# Altium project Aether.PrjPcb
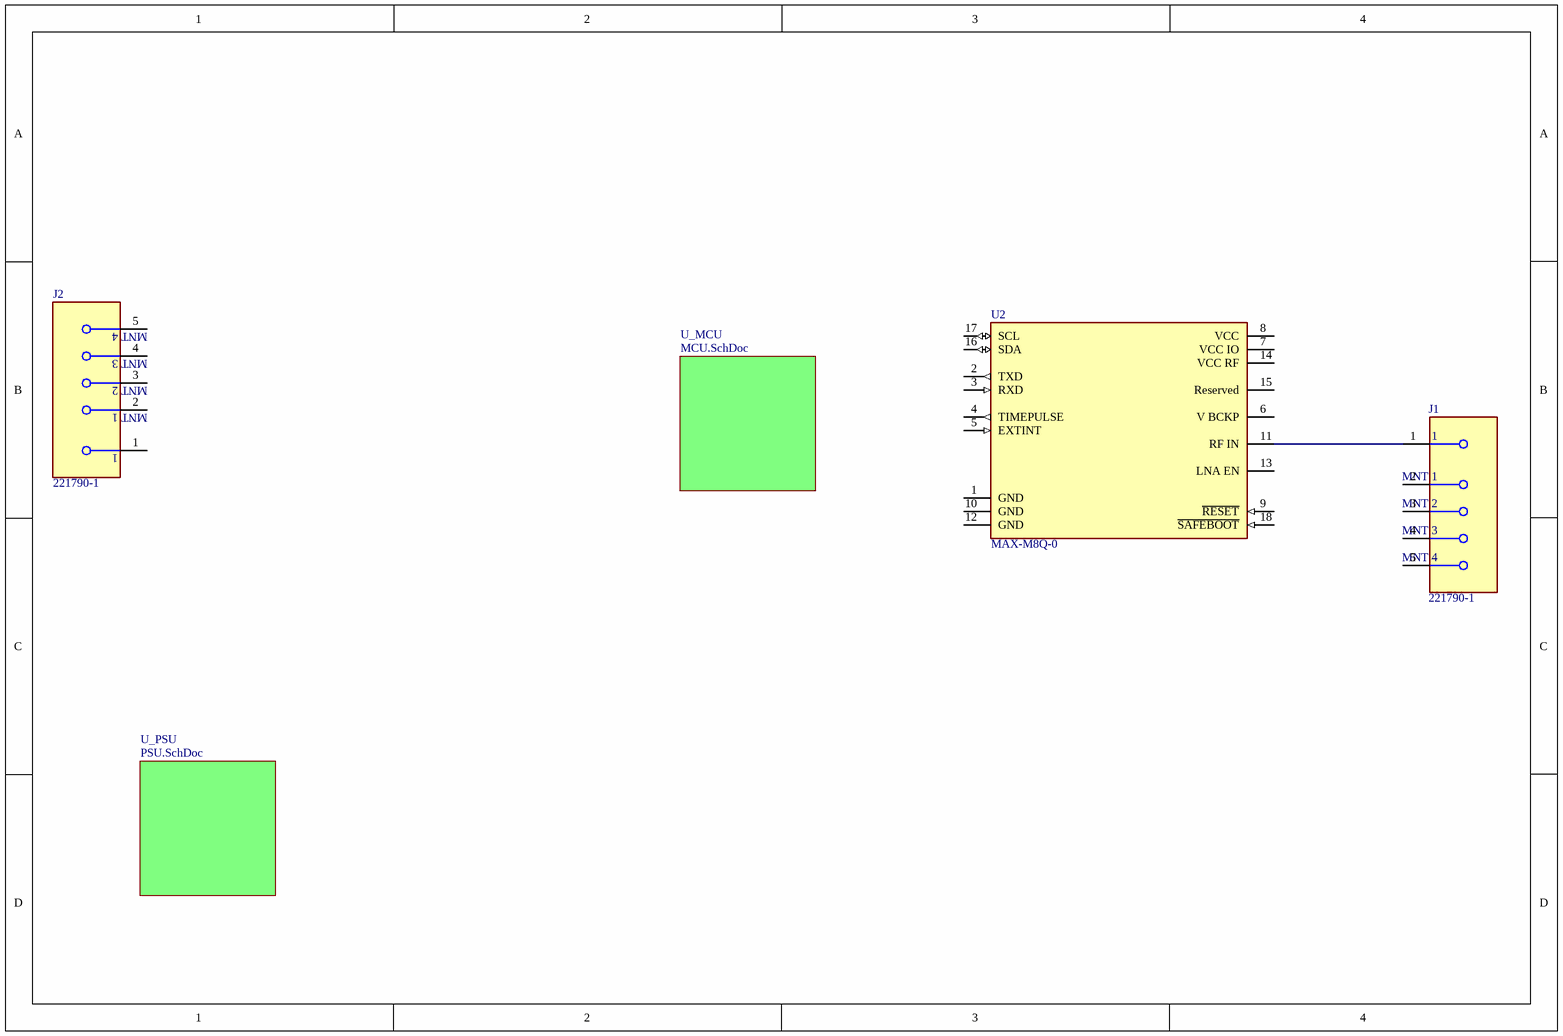
[diagram p0: main.SchDoc]
Title: testtest; Revision: 001; Project: XXX; DrawnBy: Jim Beam; Date: YYYY-MM-DD; CheckedBy: Rudolf Jelinek; ApprovedBy: Rani Srani
3 sheets, 4 parts. Net scope: global (net labels, ports and power ports of the same name join across sheets).
Board file: Aether.PcbDoc
Sheets:
  main.SchDoc
    U_MCU = MCU.SchDoc
    U_PSU = PSU.SchDoc

## Sheet main.SchDoc: testtest
size A4; Date: YYYY-MM-DD; ApprovedBy: Rani Srani; CheckedBy: Rudolf Jelinek; DrawnBy: Jim Beam; Organization: Medical Technologies CZ a.s.; Revision: 001; Version1: N/A; Version2: N/A; Version3: N/A; Change1description: N/A; Change2description: N/A; Change3description: N/A; Change1DrawnBy: N/A; Change2DrawnBy: N/A; Change3DrawnBy: N/A; Change1CheckedBy: N/A; Change2CheckedBy: N/A; Change3CheckedBy: N/A; PreviusVersion_Chng1: N/A; PreviusVersion_Chng2: N/A; PreviusVersion_Chng3: N/A; Variant1description: Standard assembly; Variant2description: N/A; Variant3description: N/A; Variant4description: N/A; PrimaryCard1: XXXxxxXXX; PrimaryCard2: N/A; PrimaryCard3: N/A; PrimaryCard4: N/A; DocumentName: Docname

### Parts
J1  221790-1  [FP-221790-1-MFG]
J2  221790-1  [FP-221790-1-MFG]
U2  MAX-M8Q-0  [FP-MAX-M8Q-0-MFG]

### Sub-sheets
U_MCU = MCU.SchDoc: no entries
U_PSU = PSU.SchDoc: no entries

### Nets
NetJ1_1: J1.1 U2.11(RF_IN)

Not connected (* = marked no-connect by the designer): J1 2(MNT_1) 3(MNT_2) 4(MNT_3) 5(MNT_4); J2 1 2(MNT_1) 3(MNT_2) 4(MNT_3) 5(MNT_4); U2 1(GND) 2(TXD) 3(RXD) 4(TIMEPULSE) 5(EXTINT) 6(V_BCKP) 7(VCC_IO) 8(VCC) 9(~{RESET}) 10(GND) 12(GND) 13(LNA_EN) 14(VCC_RF) 15(Reserved) 16(SDA) 17(SCL) 18(~{SAFEBOOT})

### Notes on the sheet
- Číslo výkresu /drawing number/:
- Nazev listu/sheet name/:
- DPS projekt/PCB project/:
- Kreslil /drawn by/ :
- Kontroloval /checked by/:
- Schvalil /approved by/:
- Podpis /signature/:
- Datum /date/:
- List /sheet/:
- /

### Library data of the parts
J1 J2 = CMP-05166-000001-1: CONN SMA JACK R/A 50 OHM PCB; Manufacturer: TE Connectivity / AMP; Is Female: yes; Impedance: 50Ω; Number Of Contacts: 1; Shielding: true; Voltage Rating: 335V; Frequency: 4GHz; Dielectric Material: Fluoropolymer; Conn Orientation: Right Angle; Octopart: https://octopart.com/2217901-te+connectivity+%2F+amp-3339836; Contact Material: Gold; Temperature: -65°C to +165°C; RoHS: TRUE; Device Class L1: Connectors; Temperature Range Low: -65°C; Mouser Description: RF Connectors / Coaxial Connectors PCB RIGHT ANGLE JACK; Lead Free: Yes; Manufacturer Part Number: 221790-1; Device Class L3: unset; Temperature Range High: +165°C; ComponentLink2URL: https://www.te.com/commerce/DocumentDelivery/DDEController?Action=showdoc&DocId=Customer+Drawing%7F221790%7FB1%7Fpdf%7FEnglish%7FENG_CD_221790_B1.pdf%7F221790-1; Package: 0; ComponentLink2Description: Datasheet; Digikey Description: CONN SMA JACK R/A 50 OHM PCB; Device Class L2: RF / Coaxial Connectors; Category: Conn; Height: 0.38inch; Automotive: No
U2 = CMP-207130-000017-1: RF RCVR GNSS/GPS 1.575GHZ 18LCC; Sensitivity: -167dBm; Current - Receiving: 23mA; Interface: I2C; Frequency: 1.575GHz; Min Operating Temperature: -40°C; Case/Package: SMD/SMT; RoHS Compliant: Yes; Packaging: Cut Tape; Max Operating Temperature: 85°C

## Sheet MCU.SchDoc: testtest
size A4; Date: YYYY-MM-DD; ApprovedBy: Rani Srani; CheckedBy: Rudolf Jelinek; DrawnBy: Jim Beam; Organization: Medical Technologies CZ a.s.; Revision: 001; Version1: N/A; Version2: N/A; Version3: N/A; Change1description: N/A; Change2description: N/A; Change3description: N/A; Change1DrawnBy: N/A; Change2DrawnBy: N/A; Change3DrawnBy: N/A; Change1CheckedBy: N/A; Change2CheckedBy: N/A; Change3CheckedBy: N/A; PreviusVersion_Chng1: N/A; PreviusVersion_Chng2: N/A; PreviusVersion_Chng3: N/A; Variant1description: Standard assembly; Variant2description: N/A; Variant3description: N/A; Variant4description: N/A; PrimaryCard1: XXXxxxXXX; PrimaryCard2: N/A; PrimaryCard3: N/A; PrimaryCard4: N/A; DocumentName: Docname
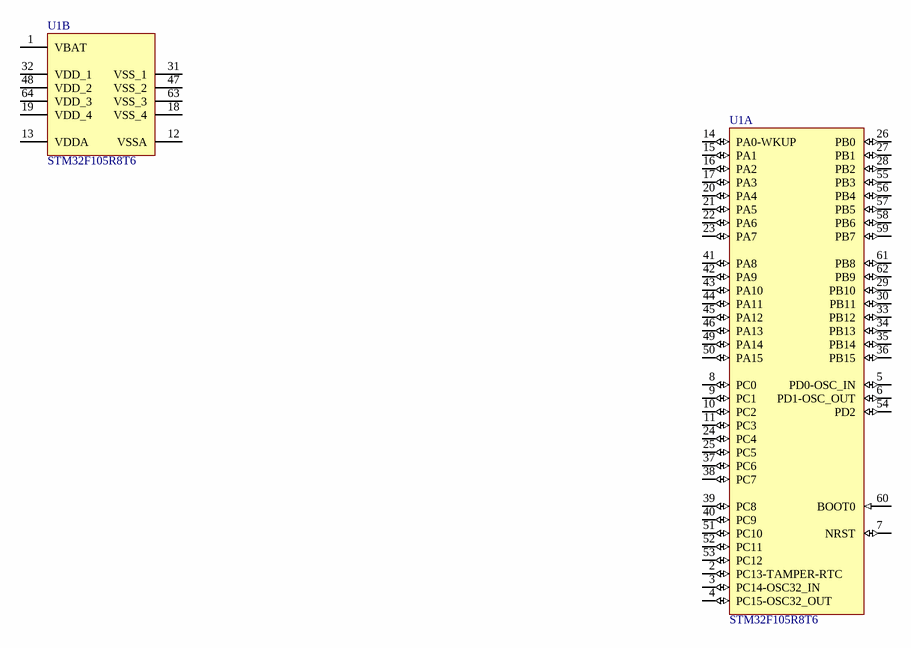
[diagram p1: MCU.SchDoc]

### Parts
U1  STM32F105R8T6  [STM-LQFP64_V]  (parts A,B of 2)

### Nets

Not connected (* = marked no-connect by the designer): U1 1(VBAT) 2(PC13-TAMPER-RTC) 3(PC14-OSC32_IN) 4(PC15-OSC32_OUT) 5(PD0-OSC_IN) 6(PD1-OSC_OUT) 7(NRST) 8(PC0) 9(PC1) 10(PC2) 11(PC3) 12(VSSA) 13(VDDA) 14(PA0-WKUP) 15(PA1) 16(PA2) 17(PA3) 18(VSS_4) 19(VDD_4) 20(PA4) 21(PA5) 22(PA6) 23(PA7) 24(PC4) 25(PC5) 26(PB0) 27(PB1) 28(PB2) 29(PB10) 30(PB11) 31(VSS_1) 32(VDD_1) 33(PB12) 34(PB13) 35(PB14) 36(PB15) 37(PC6) 38(PC7) 39(PC8) 40(PC9) 41(PA8) 42(PA9) 43(PA10) 44(PA11) 45(PA12) 46(PA13) 47(VSS_2) 48(VDD_2) 49(PA14) 50(PA15) 51(PC10) 52(PC11) 53(PC12) 54(PD2) 55(PB3) 56(PB4) 57(PB5) 58(PB6) 59(PB7) 60(BOOT0) 61(PB8) 62(PB9) 63(VSS_3) 64(VDD_3)

### Notes on the sheet
- Číslo výkresu /drawing number/:
- Nazev listu/sheet name/:
- DPS projekt/PCB project/:
- Kreslil /drawn by/ :
- Kontroloval /checked by/:
- Schvalil /approved by/:
- Podpis /signature/:
- Datum /date/:
- List /sheet/:
- /

### Library data of the parts
U1 = CMP-0237-00225-3: ARM Cortex-M3 32-bit MCU, 64 KB Flash, 64 KB Internal RAM, 51 I/Os, 64-pin LQFP, -40 to 85 degC, Tray; FLASH Size (Prog) (kB): 64; Operating Frequency(F) (Processor speed) (MHz): 72; D/A Converter: 2x12-bit (2 Channel); A/D Converter: 2x12-bit (16 Channel); Supply Voltage(Vcc) min (V): 2; I/Os (High Current): 51; PackageVersion: Rev. 4, 06/2013; PackageDescription: 64-Pin Low Profile Quad Flat Package, 10 x 10 mm Body, 0.5 mm Pitch; ComponentLink2URL: http://www.st.com/st-web-ui/static/active/en/resource/technical/document/datasheet/CD00220364.pdf; ComponentLink1URL: http://www.st.com/web/en/home.html; ComponentLink2Description: Datasheet; ComponentLink3URL: http://www.st.com/st-web-ui/static/active/en/resource/technical/document/datasheet/DM00037051.pdf; Packing: Tray; ComponentLink3Description: Package Specification; Core: ARM Cortex-M3; PartNumber: STM32F105R8T6; Internal RAM Size (kB): 64; Mounting Technology: Surface Mount; ComponentLink1Description: Manufacturer URL; DatasheetVersion: Rev. 6; PackageReference: LQFP64

## Sheet PSU.SchDoc: testtest
size A4; Date: YYYY-MM-DD; ApprovedBy: Rani Srani; CheckedBy: Rudolf Jelinek; DrawnBy: Jim Beam; Organization: Medical Technologies CZ a.s.; Revision: 001; Version1: N/A; Version2: N/A; Version3: N/A; Change1description: N/A; Change2description: N/A; Change3description: N/A; Change1DrawnBy: N/A; Change2DrawnBy: N/A; Change3DrawnBy: N/A; Change1CheckedBy: N/A; Change2CheckedBy: N/A; Change3CheckedBy: N/A; PreviusVersion_Chng1: N/A; PreviusVersion_Chng2: N/A; PreviusVersion_Chng3: N/A; Variant1description: Standard assembly; Variant2description: N/A; Variant3description: N/A; Variant4description: N/A; PrimaryCard1: XXXxxxXXX; PrimaryCard2: N/A; PrimaryCard3: N/A; PrimaryCard4: N/A; DocumentName: Docname

### Notes on the sheet
- Číslo výkresu /drawing number/:
- Nazev listu/sheet name/:
- DPS projekt/PCB project/:
- Kreslil /drawn by/ :
- Kontroloval /checked by/:
- Schvalil /approved by/:
- Podpis /signature/:
- Datum /date/:
- List /sheet/:
- /